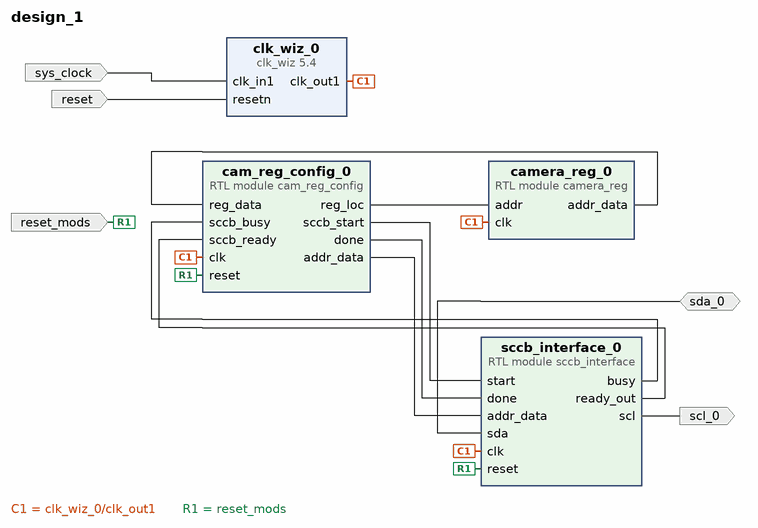
[diagram p0: block diagram of the top level]
# Vivado block design design_1, xc7a100tcsg324-1, Vivado 2017.4
create_bd_design design_1

create_bd_port -dir O scl_0
create_bd_port -dir IO sda_0
create_bd_port -dir I -type rst reset_mods
create_bd_port -dir I -type clk sys_clock
set_property -dict {CONFIG.FREQ_HZ 100000000 CONFIG.PHASE 0.000} [get_bd_ports sys_clock]
create_bd_port -dir I -type rst reset
set_property -dict {CONFIG.POLARITY ACTIVE_LOW} [get_bd_ports reset]

create_bd_cell -type module -reference camera_reg camera_reg_0
create_bd_cell -type module -reference cam_reg_config cam_reg_config_0
create_bd_cell -type module -reference sccb_interface sccb_interface_0
create_bd_cell -type ip -vlnv xilinx.com:ip:clk_wiz:5.4 clk_wiz_0
set_property -dict [list \
  CONFIG.CLKOUT1_REQUESTED_OUT_FREQ 24 \
  CONFIG.USE_LOCKED false \
  CONFIG.RESET_PORT resetn \
  CONFIG.MMCM_DIVCLK_DIVIDE 5 \
  CONFIG.MMCM_CLKFBOUT_MULT_F 50.250 \
  CONFIG.MMCM_CLKOUT0_DIVIDE_F 41.875 \
  CONFIG.RESET_TYPE ACTIVE_LOW \
  CONFIG.USE_BOARD_FLOW true \
  CONFIG.CLK_IN1_BOARD_INTERFACE sys_clock \
  CONFIG.RESET_BOARD_INTERFACE reset \
  CONFIG.CLKOUT1_JITTER 305.592 \
  CONFIG.CLKOUT1_PHASE_ERROR 298.923 \
] [get_bd_cells clk_wiz_0]

# ---- connections ----

connect_bd_net [get_bd_pins cam_reg_config_0/reg_loc] [get_bd_pins camera_reg_0/addr]
connect_bd_net [get_bd_pins camera_reg_0/addr_data] [get_bd_pins cam_reg_config_0/reg_data]
connect_bd_net [get_bd_pins cam_reg_config_0/sccb_start] [get_bd_pins sccb_interface_0/start]
connect_bd_net [get_bd_pins cam_reg_config_0/done] [get_bd_pins sccb_interface_0/done]
connect_bd_net [get_bd_pins cam_reg_config_0/addr_data] [get_bd_pins sccb_interface_0/addr_data]
connect_bd_net [get_bd_pins sccb_interface_0/busy] [get_bd_pins cam_reg_config_0/sccb_busy]
connect_bd_net [get_bd_pins sccb_interface_0/ready_out] [get_bd_pins cam_reg_config_0/sccb_ready]
connect_bd_net [get_bd_pins sccb_interface_0/scl] [get_bd_ports scl_0]
connect_bd_net [get_bd_ports sda_0] [get_bd_pins sccb_interface_0/sda]
connect_bd_net [get_bd_pins clk_wiz_0/clk_out1] [get_bd_pins camera_reg_0/clk] [get_bd_pins cam_reg_config_0/clk] [get_bd_pins sccb_interface_0/clk]
connect_bd_net -net reset_0_1 [get_bd_ports reset_mods] [get_bd_pins cam_reg_config_0/reset] [get_bd_pins sccb_interface_0/reset]
connect_bd_net [get_bd_ports sys_clock] [get_bd_pins clk_wiz_0/clk_in1]
connect_bd_net [get_bd_ports reset] [get_bd_pins clk_wiz_0/resetn]

validate_bd_design
save_bd_design
